# EasyEDA Pro project Analog_Buck.eprj

# Schematic Schematic1
Board Name: Board1; Create Date: 2025-11-09; Page Name: P1; Project Name: Analog_Buck; Schematic Name: Schematic1; Update Date: 2025-11-12; Company: 嘉立创EDA; Page Size: A4; Version: V1.0
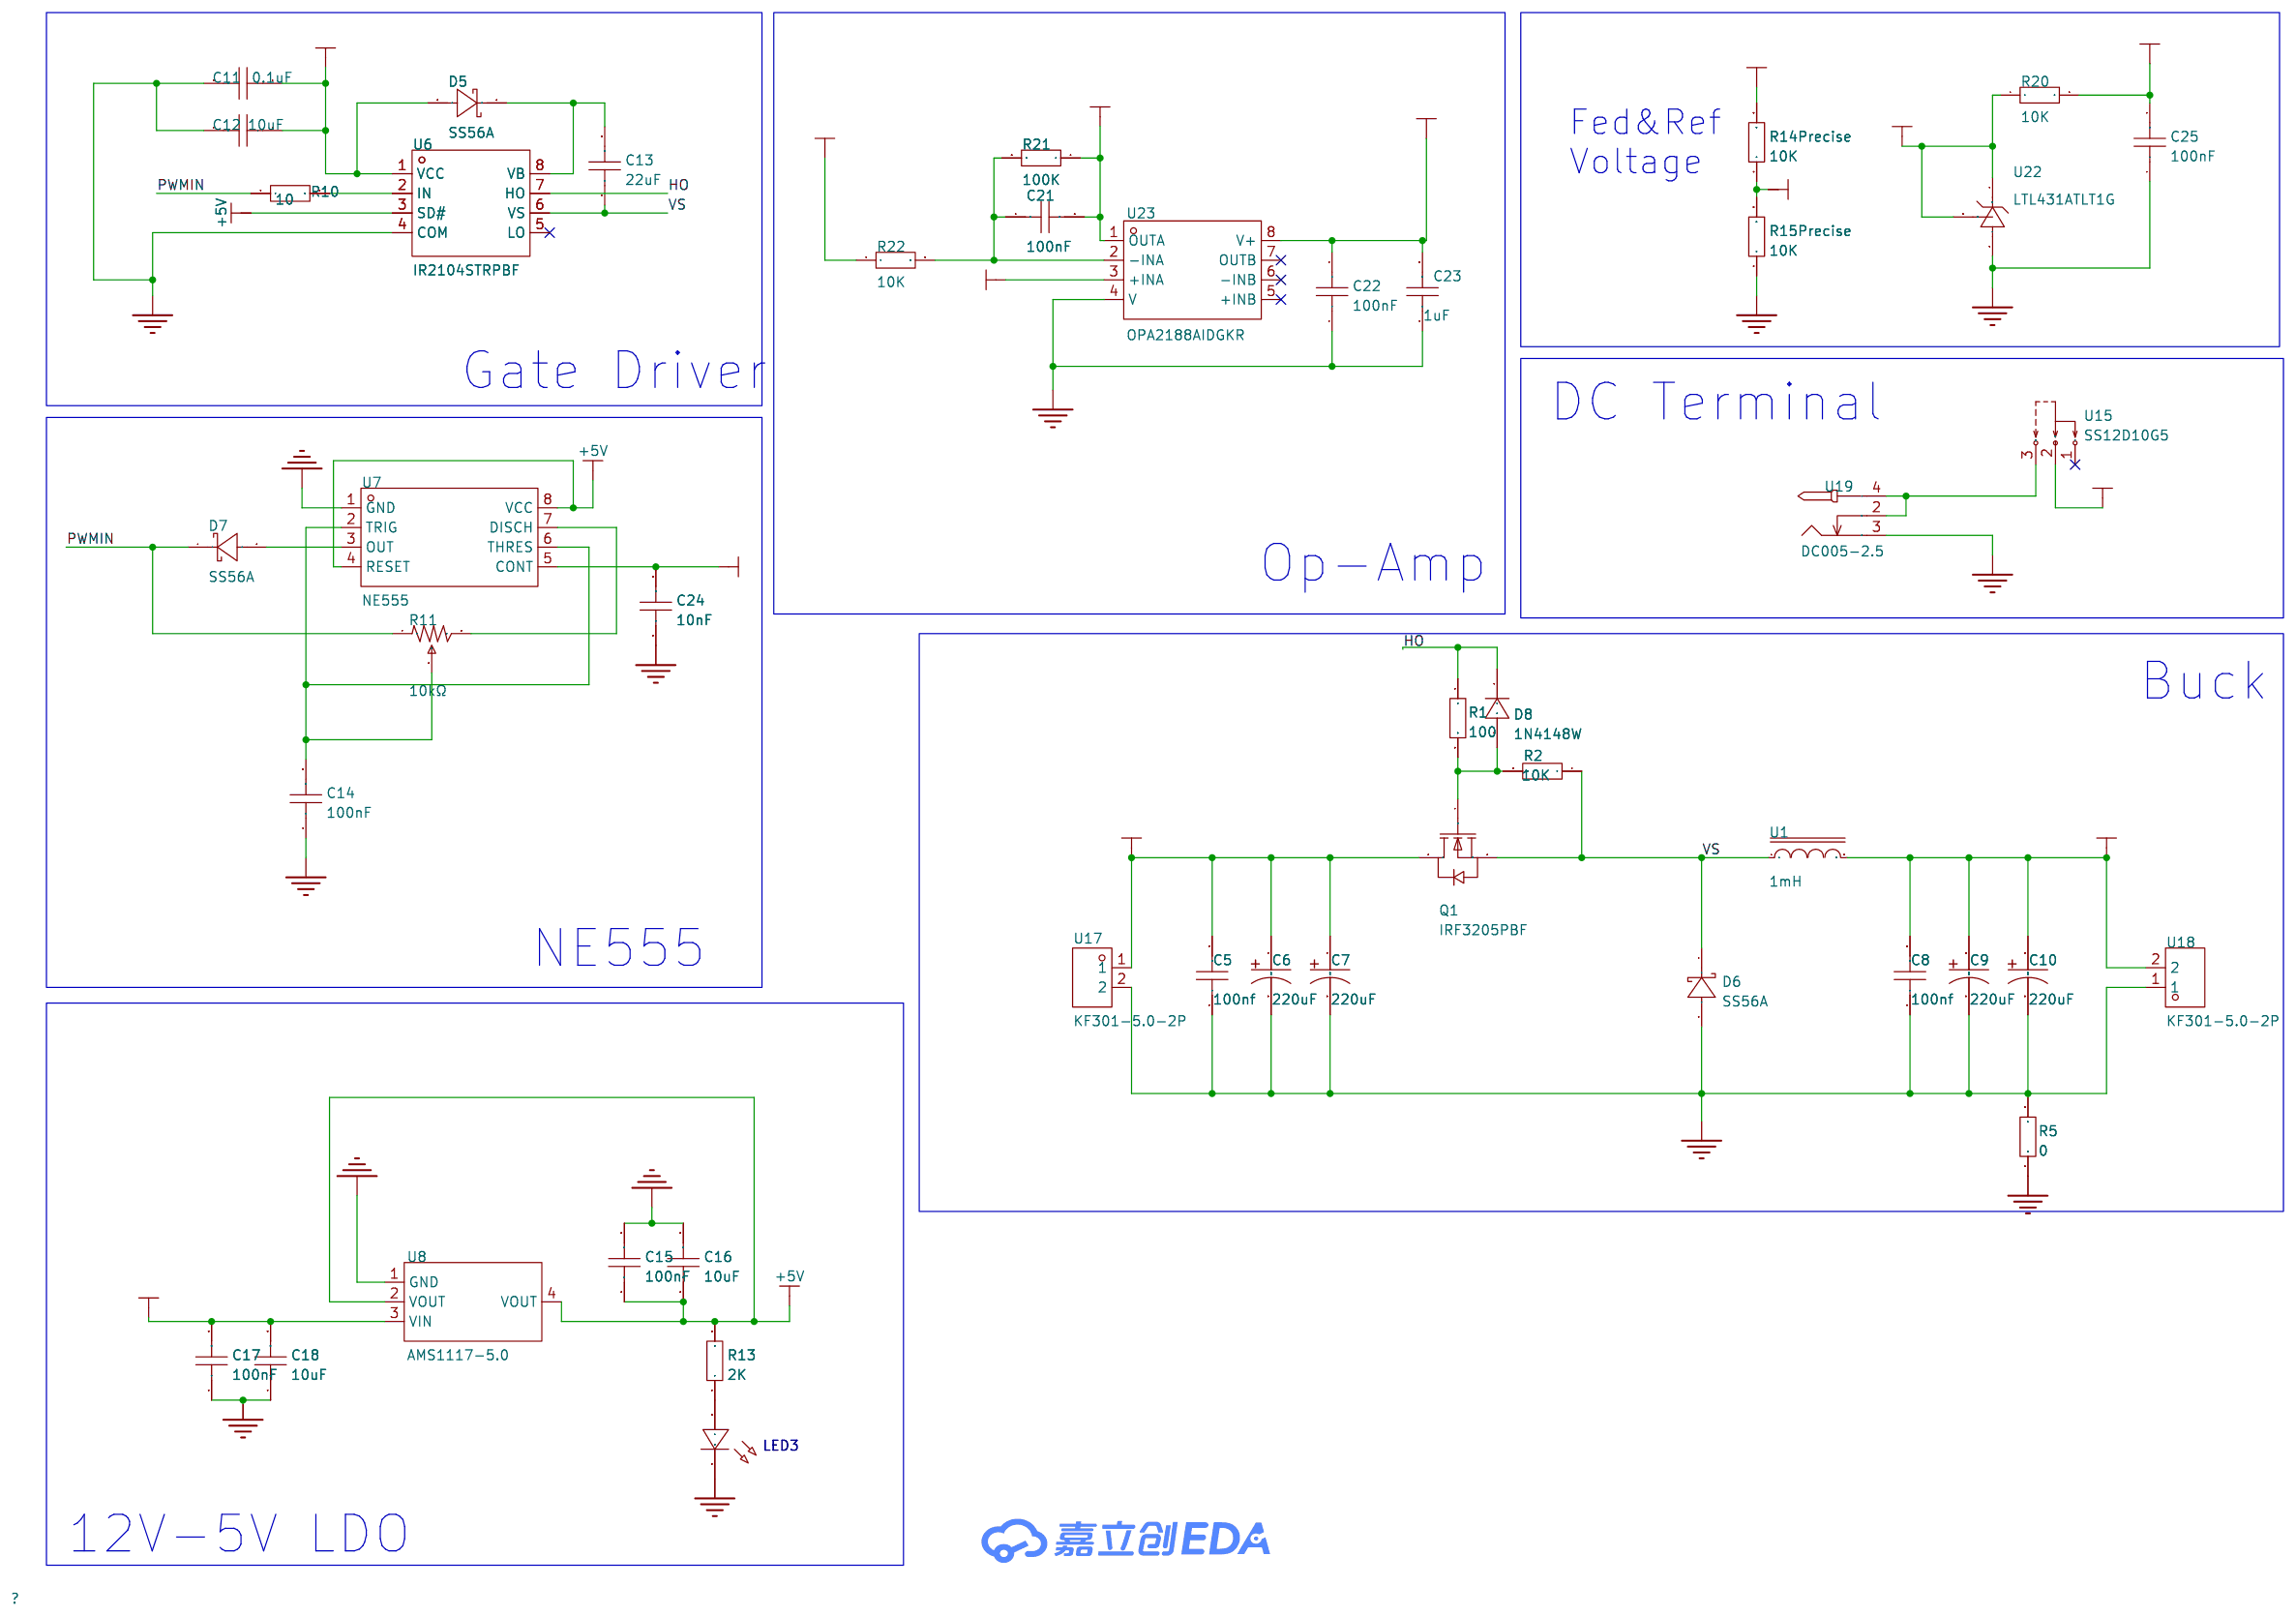
[diagram p0: schematic sheet]

## Parts
C5  100nf  [CAP-TH_L8.5-W5.0-P5.00-D1.2]
C6  220uF  [CAP-TH_BD10.0-P5.00-D0.6-FD]
C7  220uF  [CAP-TH_BD10.0-P5.00-D0.6-FD]
C8  100nf  [CAP-TH_L8.5-W5.0-P5.00-D1.2]
C9  220uF  [CAP-TH_BD10.0-P5.00-D0.6-FD]
C10  220uF  [CAP-TH_BD10.0-P5.00-D0.6-FD]
C11  0.1uF  [C0603]
C12  10uF  [C0603]
C13  22uF  [CAP-TH_L6.0-W3.8-P5.08-D0.6]
C14  100nF  [C0603]
C15  100nF  [C0603]
C16  10uF  [C0603]
C17  100nF  [C0603]
C18  10uF  [C0603]
C21  100nF  [C0603]
C22  100nF  [C0603]
C23  1uF  [C0603]
C24  10nF  [C0603]
C25  100nF  [C0603]
D5  SS56A  [SMA_L4.2-W2.6-LS5.0-RD]
D6  SS56A  [SMA_L4.2-W2.6-LS5.0-RD]
D7  SS56A  [SMA_L4.2-W2.6-LS5.0-RD]
D8  1N4148W  [SOD-123F_L2.7-W1.6-LS3.8-RD]
LED3  -  [LED_0805]
Q1  IRF3205PBF  [TO-220-3_L10.0-W4.5-P2.54-L]
R1  100  [R0603]
R2  10K  [R0603]
R5  0  [R0603]
R10  10  [R0603]
R11  10kΩ  [RES-ADJ-TH_3P-L9.5-W4.9-P2.50-L_3296W]
R13  2K  [R0603]
R14Precise  10K  [R0603]
R15Precise  10K  [R0603]
R20  10K  [R0603]
R21  100K  [R0603]
R22  10K  [R0603]
U1  1mH  [IND-TH_L33.0-W15.6-P15.00-D1.5]
U6  IR2104STRPBF  [SOIC-8_L4.9-W3.9-P1.27-LS6.0-BL]
U7  NE555  [SOP-8_L5.0-W4.0-P1.27-LS6.0-BL]
U8  AMS1117-5.0  [SOT-223_L6.5-W3.5-P2.30-LS7.0-BR]
U15  SS12D10G5  [SW-TH_SHOU-HAN_SS12D10G4]
U17  KF301-5.0-2P  [CONN-TH_P5.00_KF301-5.0-2P]
U18  KF301-5.0-2P  [CONN-TH_P5.00_KF301-5.0-2P]
U19  DC005-2.5  [DC-IN-TH_DC005-2.5MM]
U22  LTL431ATLT1G  [SOT-23-3_L2.9-W1.3-P1.90-LS2.4-BR]
U23  OPA2188AIDGKR  [VSSOP-8_L3.0-W3.0-P0.65-LS4.9-BL]

## Library data of the parts
C5 C8 = CT4-0805B104K500F3: 容值:100nF;精度:±10%;额定电压:50V;温度系数:X7R;; LCSC Part Name: 100nF ±10% 50V C3型（直脚）; Supplier Part: C84772; Manufacturer: FH(风华); Supplier Footprint: 插件,P=5.08mm; JLCPCB Part Class: 扩展库; Datasheet: https://atta.szlcsc.com/upload/public/pdf/source/20190402/C385200_059806A6312B28FF1421A2413EB641E1.pdf; Supplier: LCSC; Tolerance: ±10%; Voltage Rated: 50V; Temperature Coefficient: X7R
C6 C7 C9 C10 = ECF1JM221G17OTPO: LCSC Part Name: 220uF ±20% 63V; Supplier Part: C783503; Manufacturer: Yunxing(云星); Supplier Footprint: 插件,D10xL17mm; JLCPCB Part Class: Extended Part; Datasheet: https://item.szlcsc.com/datasheet/ECF1JM221G17OTPO/837828.html; Supplier: LCSC; Tolerance: ±20%; Voltage Rating: 63V; Diameter: 10mm; Height - Seated (Max): 17mm; Lifetime: 6000hrs@105℃; Operating Temperature: -40℃~+105℃
C11 C12 C14-C18 C21-C25 = CAP_0603: Supplier Footprint: 0603
C13 = CD1H225KC9BER1F100: 容值:2.2uF;精度:±10%;额定电压:50V;温度系数:X7R;; LCSC Part Name: 2.2uF ±10% 50V; Supplier Part: C2976626; Manufacturer: Dersonic(德尔创); Supplier Footprint: 插件,P=5.08mm; JLCPCB Part Class: Extended Part; Datasheet: https://item.szlcsc.com/datasheet/CD1H225KC9BER1F100/3383616.html; Supplier: LCSC; Tolerance: ±10%; Voltage Rating: 50V; Temperature Coefficient: X7R
D5-D7 = SS56A: 二极管配置:独立式;正向压降(Vf):700mV@5A;直流反向耐压(Vr):60V;整流电流:5A;; LCSC Part Name: 电压:60V 电流:5A; Supplier Part: C842793; Manufacturer: FUXINSEMI(富芯森美); Supplier Footprint: SMA(DO-214AC); JLCPCB Part Class: 扩展库; Datasheet: https://item.szlcsc.com/datasheet/SS56A/901411.html; Supplier: LCSC; Diode Configuration: 独立式; Voltage - Forward(Vf@If): 700mV@5A; Voltage - DC Reverse(Vr): 60V; Current - Rectified: 5A; Reverse Leakage Current (Ir): 500nA; Operating Junction Temperature Range: -55℃~+150℃; Non-Repetitive Peak Forward Surge Current: 150A
D8 = 1N4148W_C81598: Supplier Part: C81598; Manufacturer: ST(先科); Supplier Footprint: SOD-123; JLCPCB Part Class: 基础库; Datasheet: https://item.szlcsc.com/datasheet/1N4148W/82750.html; Supplier: LCSC; Diode Configuration: 独立式; Voltage - Forward(Vf@If): 1V@50mA; Voltage - DC Reverse(Vr): 75V; Current - Rectified: 150mA; Pd - Power Dissipation: 400mW; Reverse Leakage Current (Ir): 1uA@75V; Reverse Recovery Time (trr): 4ns; Non-Repetitive Peak Forward Surge Current: 1A
LED3 = LED_0805-G: Supplier Footprint: 0805
Q1 = IRF3205PBF: 类型:1个N沟道;漏源电压(Vdss):55V;连续漏极电流(Id):110A;导通电阻(RDS(on)@Vgs,Id):8mΩ@10V,62A;功率(Pd):200W;阈值电压(Vgs(th)@Id):4V@250uA;; LCSC Part Name: 1个N沟道 耐压:55V 电流:110A; Supplier Part: C2561; Manufacturer: Infineon(英飞凌); Supplier Footprint: TO-220AB; JLCPCB Part Class: 扩展库; Datasheet: https://atta.szlcsc.com/upload/public/pdf/source/20201126/C2561_C063ADD03C5ACFC796E423BE08ECDD89.pdf; Supplier: LCSC; Type: 1个N沟道; Drain Source Voltage (Vdss): 55V; Continuous Drain Current (Id): 110A; Drain Source On Resistance (RDS(on)@Vgs,Id): 8mΩ@10V,62A; Power Dissipation (Pd): 200W; Gate Threshold Voltage (Vgs(th)@Id): 4V@250uA; Total Gate Charge (Qg@Vgs): 146nC; Input Capacitance (Ciss@Vds): 3.247nF; Reverse Transfer Capacitance (Crss@Vds): 211pF; Operating Temperature: -55℃~+175℃
R1 R2 R5 R10 R13 R14Precise R15Precise R20-R22 = Res_0603: Supplier Footprint: 0603
R11 = 3296W-1-103LF_C49190453: LCSC Part Name: 3296W-1-103LF; Supplier Part: C49190453; Manufacturer: JIERR(捷而瑞); Manufacturer Part: 3296W-1-103LF; Supplier Footprint: 插件-3P,9.5x4.9mm; JLCPCB Part Class: 扩展库; Datasheet: https://item.szlcsc.com/datasheet/3296W-1-103LF/51587046.html; Supplier: LCSC; Tolerance: ±10%; Power(Watts): 500mW; Temperature Coefficient: ±250ppm/℃; Number of Turns: 28
U1 = XR106125TS470MV1L5: 电感值:47uH;精度:±10%;额定电流:12A;类型:磁环电感;; LCSC Part Name: 47uH ±10% 磁环电感; Supplier Part: C22358529; Manufacturer: XR(祥如); Supplier Footprint: 插件,33x15.6mm; JLCPCB Part Class: 扩展库; Datasheet: https://atta.szlcsc.com/upload/public/pdf/source/20240313/975BD6823DE6C304357683F4CE864895.pdf; Supplier: LCSC; Tolerance: ±10%; Rated Current: 12A; Type: 磁环电感; Wire Diameter: 1.5mm
U6 = IR2104STRPBF: 驱动配置:半桥;负载类型:IGBT；MOSFET;驱动通道数:2;灌电流(IOL):270mA;拉电流(IOH):130mA;工作电压:10V~20V;上升时间(tr):100ns;下降时间(tf):50ns;; LCSC Part Name: 半桥驱动器; Supplier Part: C2960; Manufacturer: Infineon(英飞凌); Supplier Footprint: SOIC-8; JLCPCB Part Class: 扩展库; Datasheet: https://item.szlcsc.com/datasheet/IR2104STRPBF/3342.html; Supplier: LCSC; Driven Configuration: 半桥; Load Type: IGBT；MOSFET; Number of Drivers: 2; Current - Output Low(IOL): 270mA; Current - Output High(IOH): 130mA; Voltage - Supply: 10V~20V; Rise Time: 100ns; Fall Time: 50ns; Propagation Delay tpLH: 680ns; Propagation Delay tpHL: 150ns; Features: 欠压保护(UVP); Operating Temperature: -40℃~+150℃@(Tj); Quiescent Current(Iq): 150uA
U7 = NE555: Supplier Part: C504549; Supplier Footprint: SOP-8-4.0mm; JLCPCB Part Class: 扩展库; Supplier: LCSC
U8 = AMS1117-5.0_C6187: LCSC Part Name: 输入15V 输出5V 1A; Supplier Part: C6187; Manufacturer: AMS; Supplier Footprint: SOT-223; JLCPCB Part Class: 基础库; Datasheet: https://item.szlcsc.com/datasheet/AMS1117-5.0/6653.html; Supplier: LCSC; Output Type: 固定; Voltage - Supply: 15V; Output Voltage: 5V; Output Current: 1A; Power Supply Rejection Ratio (PSRR): 60dB; Voltage Dropout: 1.3V; Operating Temperature: -40℃~+125℃; Output Configuration: 正极; Number of Outputs: 1
U15 = SS12D10G5: 电路结构:单刀双掷;安装方式:直插;额定电流:2A;额定电压:125V;工作寿命:3千次;; LCSC Part Name: 两档立式插件 3脚拨动开关 柄长5.0mm; Supplier Part: C7431054; Manufacturer: SHOU HAN(首韩); Supplier Footprint: 插件,12.7x6.7mm; JLCPCB Part Class: 扩展库; Datasheet: https://item.szlcsc.com/datasheet/SS12D10G5/8431406.html; Supplier: LCSC; Circuit: 单刀双掷; Length: 12.7mm; Width: 6.7mm; Mounting Type: 直插; Current Rating: 2A; Voltage Rating: 125V; Life: 3千次; Operating Temperature: -25℃~+70℃
U17 U18 = KF301-5.0-2P: 结构:1x2P;间距:5mm;颜色:蓝色;安装方式:直插;额定电流:17A;额定电压:250V;排数:1;线规 - AWG:14~22;线规 - 平方毫米:1.5;每排PIN数:2;工作温度范围:-30℃~+120℃;; LCSC Part Name: 5mm 1x2P 排数:1 每排P数:2 直插; Supplier Part: C474881; Manufacturer: KEFA(科发); Supplier Footprint: 插件,P=5mm; JLCPCB Part Class: 扩展库; Datasheet: https://atta.szlcsc.com/upload/public/pdf/source/20230317/03A5B5FC229D6F9225E8F51DA1A4E80A.pdf; Supplier: LCSC; Structure: 1x2P; Pitch: 5mm; Color: 蓝色; Mounting Style: 直插; Current Rating (Max): 17A; Voltage Rating (Max): 250V; Number of Pins: 2P; Number of Rows: 1; Wire Gauge - AWG: 14~22; Wire Gauge - mm2: 1.5; Number of PINs Per Row: 2; Operating Temperature Range: -30℃~+120℃
U19 = DC005-2.5: LCSC Part Name: DC电源插座 内径:2.5mm 外径:6.3mm; Supplier Part: C7507454; Manufacturer: SHOU HAN(首韩); Supplier Footprint: 插件; JLCPCB Part Class: 扩展库; Datasheet: https://item.szlcsc.com/datasheet/DC005-2.5/8598476.html; Supplier: LCSC; Connector Type: DC电源插座; Mounting Type: 弯插; Inside Contact Diameter: 2.5mm; Outside Contact Diameter: 6.3mm; Current Rating: 500mA; Voltage Rating (Max): 30V; Operating Temperature: -25℃~+70℃
U22 = LTL431ATLT1G: LCSC Part Name: 2.5V~36V 100mA; Supplier Part: C83052; Manufacturer: LRC(乐山无线电); Supplier Footprint: SOT-23(SOT-23-3); JLCPCB Part Class: Extended Part; Datasheet: https://atta.szlcsc.com/upload/public/pdf/source/20161024/1477288490977.pdf; Supplier: LCSC; Output Type: 可编程; Output Voltage: 2.5V~36V; Output Current: 100mA; Minimum Cathode Current for Regulation: 1mA; Operating Temperature: -40℃~+125℃@(TA)
U23 = OPA2188AIDGKR: Supplier Part: C2865632; Manufacturer: TI(德州仪器); Supplier Footprint: VSSOP-8; JLCPCB Part Class: 扩展库; Datasheet: https://www.ti.com/cn/lit/gpn/opa2188; Supplier: LCSC; Number of Channels: 双路; Gain Bandwidth Product: 2MHz; Ib - Input Bias Current: 160pA; Vos - Input Offset Voltage: 6uV; Slew Rate: 0.8V/us; Operating Temperature: -40℃~+105℃

## Nets
+5V: C15.1 C16.1 R13.2 U6.3(SD#) U7.4(RESET) U7.8(VCC) U8.2(VOUT) U8.4(VOUT)
+12V: C11.1 C12.1 C17.2 C18.2 C22.2 C23.2 C25.2 D5.2(A) R20.2 U6.1(VCC) U8.3(VIN) U15.2 U23.8(V+)
DGND: C11.2 C12.2 C14.1 C15.2 C16.2 C17.1 C18.1 C22.1 C23.1 C24.1 C25.1 LED3.1(C) R5.1 U6.4(COM) U7.1(GND) U8.1(GND) U19.3 U22.3(A) U23.4(V)
GND: C5.1 C6.2 C7.2 C8.1 C9.2 C10.2 D6.2(A) R5.2 R15Precise.1 U17.2 U18.1
VIN: C5.2 C6.1 C7.1 Q1.2(D) U17.1
HO: D8.1(K) R1.1 U6.7(HO)
PWMIN: D7.1(K) R10.1 R11.1
VCON: C21.2 C24.2 R21.1 U7.5(CONT) U23.1(OUTA)
VFB: R14Precise.1 R15Precise.2 R22.1
VOUT: C8.2 C9.1 C10.1 R14Precise.2 U1.2 U18.2
VREF: R20.1 U22.1(C) U22.2(REF) U23.3(+INA)
VS: C13.1 D6.1(K) Q1.3(S) R2.1 U1.1 U6.6(VS)
$1N485: C13.2 D5.1(K) U6.8(VB)
$1N490: R10.2 U6.2(IN)
$1N1299: D8.2(A) Q1.1(G) R1.2 R2.2
$1N2292: D7.2(A) U7.3(OUT)
$1N2346: C14.2 R11.2 U7.2(TRIG) U7.6(THRES)
$1N2402: R11.3 U7.7(DISCH)
$1N3368: U15.3 U19.2 U19.4
$1N5855: LED3.2(A) R13.1
$1N13692: C21.1 R21.2 R22.2 U23.2(-INA)

Not connected (* = marked no-connect by the designer): U6 5(LO)*; U15 1*; U23 5(+INB)* 6(-INB)* 7(OUTB)*

## Notes on the sheet
- Fed&Ref
  Voltage
- Gate Driver
- DC Terminal
- Op-Amp
- Buck
- NE555
- 12V-5V LDO

# Board PCB1
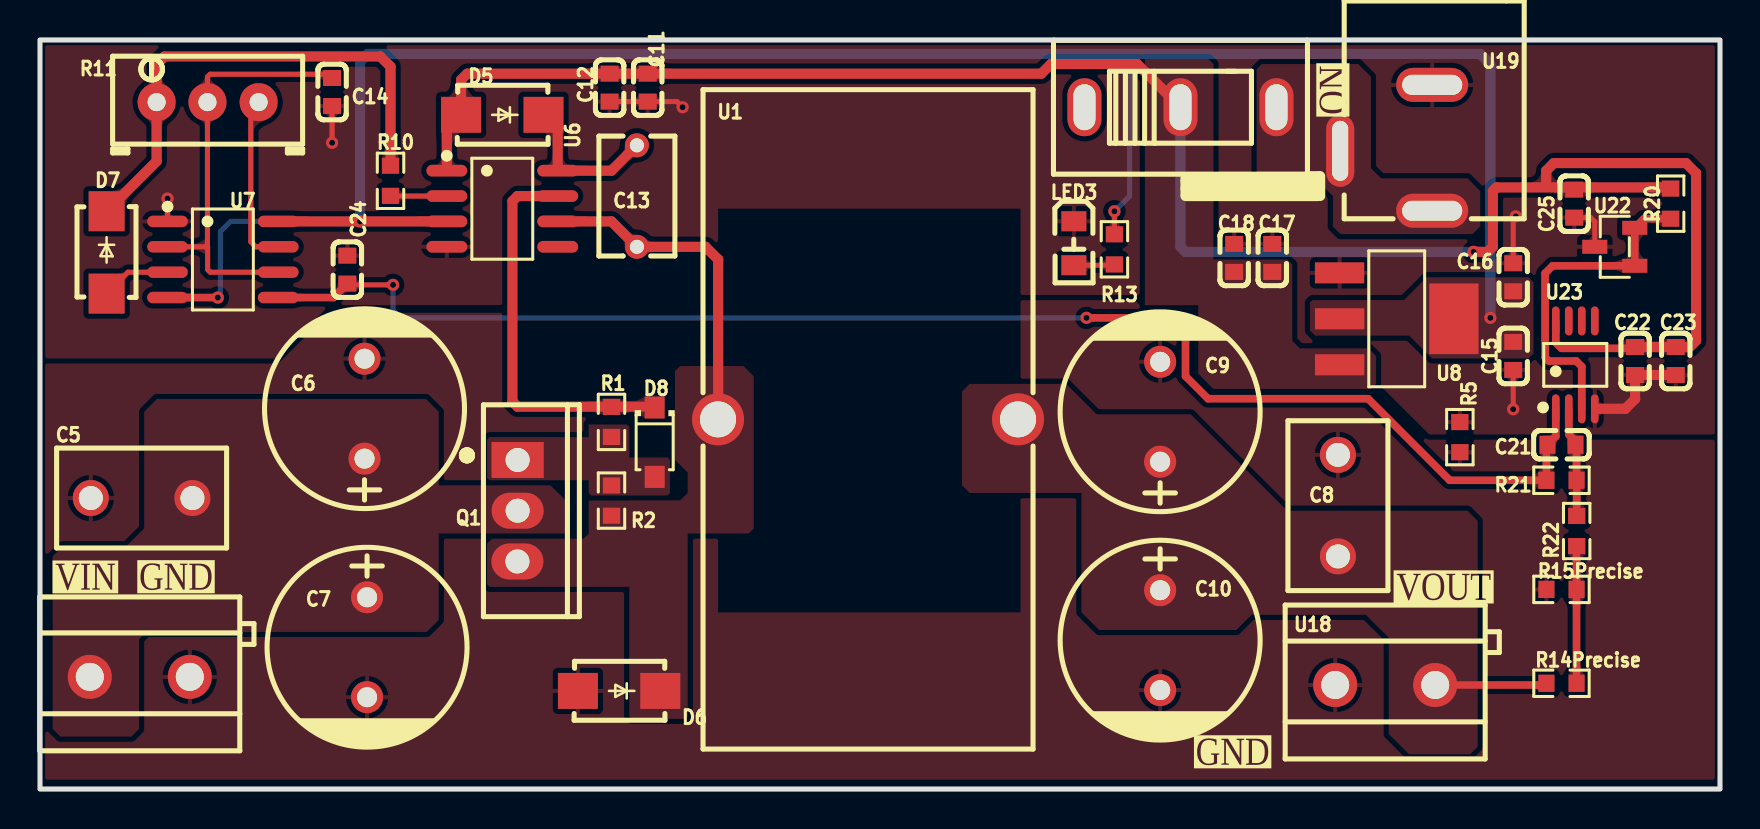
[diagram p1: board, top side]
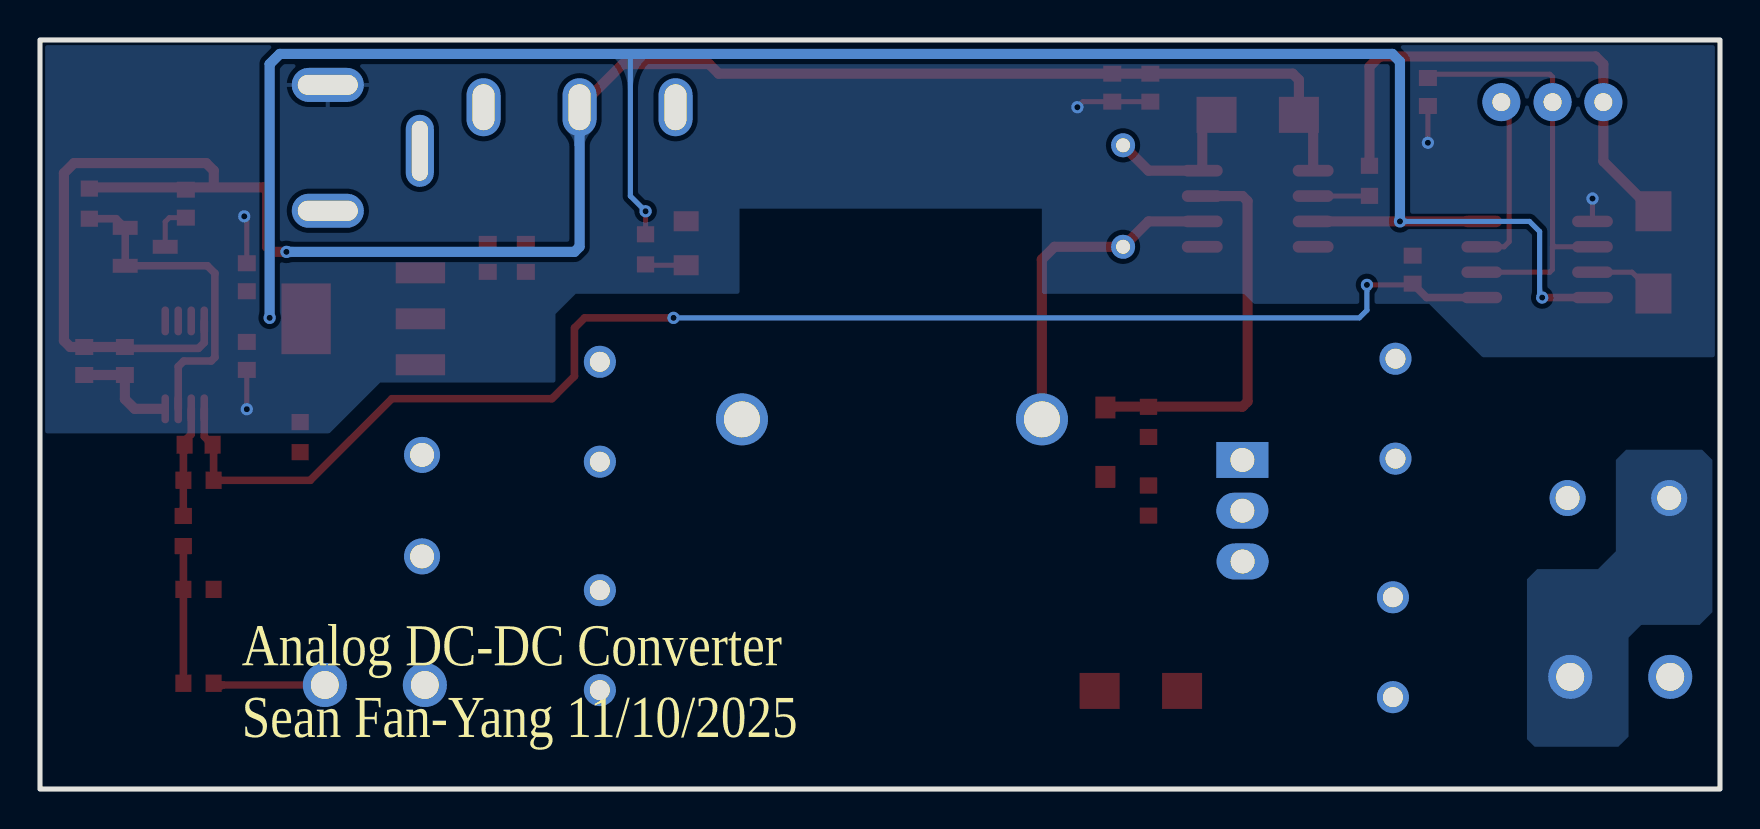
[diagram p2: board, bottom side, seen from below]

Outline 84 x 37.49 mm; copper layers: Top Layer, Bottom Layer. Coordinates in mm from the lower left corner of the outline.
Outline path: rectangle 0,37.49 84,0
Stack: Top Layer 0.035mm / Dielectric1 1.51mm FR4 er 4.5 / Bottom Layer 0.035mm

## Design rules (mm)
template: JLCPCB Capability(Two Layers Board)
spacing copperThickness1oz (default): track to track 0.102, other pairs 0.152 to 0.3
spacing copperThickness2oz: track to track 0.203, other pairs 0.152 to 0.3
track width copperThickness1oz (default): min 0.127, default 0.254, max 2.54
track width copperThickness2oz: min 0.203, default 0.254, max 2.54
differential pair differentialPair (default): width min 0.127, default 0.254, max 2.54; gap min 0.152, default 0.152
via viaSize (default): diameter min 0.5, default 0.61, max 10; hole min 0.3, default 0.305, max 6.3

## Placement (name value [footprint] x y rotation side)
C5  100nf  [CAP-TH_L8.5-W5.0-P5.00-D1.2]  5.08 14.56 0 top
C6  220uF  [CAP-TH_BD10.0-P5.00-D0.6-FD]  16.23 19.03 90 top
C7  220uF  [CAP-TH_BD10.0-P5.00-D0.6-FD]  16.35 7.1 270 top
C8  100nf  [CAP-TH_L8.5-W5.0-P5.00-D1.2]  64.9 14.18 270 top
C9  220uF  [CAP-TH_BD10.0-P5.00-D0.6-FD]  56.01 18.88 90 top
C10  220uF  [CAP-TH_BD10.0-P5.00-D0.6-FD]  56.01 7.45 270 top
C11  0.1uF  [C0603]  30.39 35.1 270 top
C12  10uF  [C0603]  28.48 35.1 270 top
C13  22uF  [CAP-TH_L6.0-W3.8-P5.08-D0.6]  29.84 29.68 90 top
C14  100nF  [C0603]  14.61 34.88 90 top
C15  100nF  [C0603]  73.66 21.67 270 top
C16  10uF  [C0603]  73.66 25.61 90 top
C17  100nF  [C0603]  61.61 26.58 270 top
C18  10uF  [C0603]  59.71 26.58 270 top
C21  100nF  [C0603]  76.07 17.23 180 top
C22  100nF  [C0603]  79.76 21.42 90 top
C23  1uF  [C0603]  81.79 21.42 90 top
C24  10nF  [C0603]  15.37 25.99 270 top
C25  100nF  [C0603]  76.71 29.3 90 top
D5  SS56A  [SMA_L4.2-W2.6-LS5.0-RD]  23.11 33.74 180 top
D6  SS56A  [SMA_L4.2-W2.6-LS5.0-RD]  28.96 4.91 180 top
D7  SS56A  [SMA_L4.2-W2.6-LS5.0-RD]  3.33 26.85 270 top
D8  1N4148W  [SOD-123F_L2.7-W1.6-LS3.8-RD]  30.73 17.36 270 top
LED3  -  [LED_0805]  51.69 27.26 270 top
Q1  IRF3205PBF  [TO-220-3_L10.0-W4.5-P2.54-L]  23.88 13.93 270 top
R1  100  [R0603]  28.57 18.37 270 top
R2  10K  [R0603]  28.57 14.44 90 top
R5  0  [R0603]  70.99 17.61 270 top
R10  10  [R0603]  17.53 30.44 270 top
R11  10kΩ  [RES-ADJ-TH_3P-L9.5-W4.9-P2.50-L_3296W]  8.38 34.38 0 top
R13  2K  [R0603]  53.72 27.01 90 top
R14Precise  10K  [R0603]  76.07 5.29 180 top
R15Precise  10K  [R0603]  76.07 9.99 0 top
R20  10K  [R0603]  81.53 29.3 90 top
R21  100K  [R0603]  76.07 15.45 0 top
R22  10K  [R0603]  76.84 12.91 90 top
U1  1mH  [IND-TH_L33.0-W15.6-P15.00-D1.5]  41.4 18.5 0 top
U6  IR2104STRPBF  [SOIC-8_L4.9-W3.9-P1.27-LS6.0-BL]  23.11 29.04 270 top
U7  NE555  [SOP-8_L5.0-W4.0-P1.27-LS6.0-BL]  9.14 26.5 270 top
U8  AMS1117-5.0  [SOT-223_L6.5-W3.5-P2.30-LS7.0-BR]  67.84 23.53 180 top
U15  SS12D10G5  [SW-TH_SHOU-HAN_SS12D10G4]  57.02 34.12 0 top
U17  KF301-5.0-2P  [CONN-TH_P5.00_KF301-5.0-2P]  4.99 5.61 0 top
U18  KF301-5.0-2P  [CONN-TH_P5.00_KF301-5.0-2P]  67.26 5.21 0 top
U19  DC005-2.5  [DC-IN-TH_DC005-2.5MM]  67.31 32.09 270 top
U22  LTL431ATLT1G  [SOT-23-3_L2.9-W1.3-P1.90-LS2.4-BR]  78.74 27.14 0 top
U23  OPA2188AIDGKR  [VSSOP-8_L3.0-W3.0-P0.65-LS4.9-BL]  76.76 21.23 0 top

## Footprints (pads in the part's own frame, mm; a bottom-side part is the same pattern mirrored in y, then rotated)
C0603
  rect 0.8x0.9 smd: 1(-0.7,0) 2(0.7,0)
CAP-TH_BD10.0-P5.00-D0.6-FD
  round 1.6 hole 1: 1(-2.5,0) 2(2.5,0)
CAP-TH_L6.0-W3.8-P5.08-D0.6
  round 1.2 hole 0.7: 1(-2.54,0) 2(2.54,0)
CAP-TH_L8.5-W5.0-P5.00-D1.2
  round 1.8 hole 1.2: 1(-2.54,0) 2(2.54,0)
CONN-TH_P5.00_KF301-5.0-2P
  round 2.2 hole 1.4: 1(-2.5,0) 2(2.5,0)
DC-IN-TH_DC005-2.5MM
  oval 3.6x1.4 hole 3x0.8: 2(0.15,-2.3)
  oval 1.7x3.6 hole 1x3: 3(-3.15,2.3) 4(3.15,2.3)
IND-TH_L33.0-W15.6-P15.00-D1.5
  round 2.6 hole 1.8: 1(-7.5,0) 2(7.5,0)
LED_0805
  rect 1x1.25 smd: 1(-1.15,0.005) 2(1.05,0.005)
R0603
  rect 0.806x0.864 smd: 1(-0.753,0) 2(0.753,0)
RES-ADJ-TH_3P-L9.5-W4.9-P2.50-L_3296W
  round 1.9 hole 0.9: 1(-2.55,0) 2(-0.01,0) 3(2.55,0)
SMA_L4.2-W2.6-LS5.0-RD
  rect 2x1.8 smd: 1(-2.06,0) 2(2.06,0)
SOD-123F_L2.7-W1.6-LS3.8-RD
  rect 1.1x1 smd: 1(-1.735,0) 2(1.735,0)
SOIC-8_L4.9-W3.9-P1.27-LS6.0-BL
  oval 0.588x2.045 smd: 1(-1.905,-2.772) 2(-0.635,-2.772) 3(0.635,-2.772) 4(1.905,-2.772) 5(1.905,2.772) 6(0.635,2.772) 7(-0.635,2.772) 8(-1.905,2.772)
SOP-8_L5.0-W4.0-P1.27-LS6.0-BL
  oval 0.574x2.035 smd: 1(-1.905,-2.768) 2(-0.635,-2.768) 3(0.635,-2.768) 4(1.905,-2.768) 5(1.905,2.768) 6(0.635,2.768) 7(-0.635,2.768) 8(-1.905,2.768)
SOT-23-3_L2.9-W1.3-P1.90-LS2.4-BR
  rect 1.25x0.7 smd: 1(1,-0.95) 2(1,0.95) 3(-1,0)
SOT-223_L6.5-W3.5-P2.30-LS7.0-BR
  rect 2.465x1.05 smd: 1(2.857,-2.3) 2(2.857,0) 3(2.857,2.3)
  rect 2.465x3.54 smd: 4(-2.857,0)
SW-TH_SHOU-HAN_SS12D10G4
  oval 1.7x2.9 hole 1.1x2.3: 1(-4.8,0) 2(0,0) 3(4.8,0)
TO-220-3_L10.0-W4.5-P2.54-L
  rect 1.8x2.6 hole 1.2: 1(-2.54,0.005)
  oval 1.8x2.6 hole 1.2: 2(0,0.005) 3(2.54,-0.005)
VSSOP-8_L3.0-W3.0-P0.65-LS4.9-BL
  oval 0.38x1.45 smd: 1(-0.975,-2.2) 2(-0.325,-2.2) 3(0.325,-2.2) 4(0.975,-2.2) 5(0.975,2.2) 6(0.325,2.2) 7(-0.325,2.2) 8(-0.975,2.2)

## Nets
As in the schematic.

Pads without a net: U6 5; U15 1; U23 5 6 7

## Via types
v1: diameter 0.61, hole 0.305, Top Layer to Bottom Layer, 12 vias

## Routing (per net, layer and track width the routed paths; a pad name or vN(x,y) marks a point on that pad's centre or on a via; arc(x,y) is an arc through that point)
+5V: length 108
  Top Layer w0.254: v1(53.72,28.91) R13.2
  Top Layer w0.381: U7.4 v1(8.89,24.6)
  Top Layer w0.508: 12.17,28.41 v1(16,28.41) U6.3
  Bottom Layer w0.254: v1(16,28.41) 9.53,28.41 9.02,27.9 9.02,24.72 v1(8.89,24.6) ; 54.48,36.66 54.48,29.68 v1(53.72,28.91)
  Bottom Layer w0.508: v1(16,28.41) 16,36.41 16.38,36.79 72.01,36.79 72.52,36.28 v1(72.52,23.58)
+12V: length 102
  Top Layer w0.381: C22.2 79.69,22.06 76.07,22.06 75.79,22.34 U23.8
  Top Layer w0.508: C22.2 C23.2 82.49,22.12 82.8,22.44 82.8,30.82 82.3,31.33 75.69,31.33 75.31,30.95 75.31,30.18 ; U15.2 54.86,36.28 50.55,36.28 50.07,35.8 C11.1 C12.1 21.36,35.8 21.05,35.49 D5.2 20.34,33.03 U6.1 ; R20.2 81.47,30.11 72.82,30.11 72.64,29.93 72.64,27.14 72.39,26.88 v1(71.68,26.88)
  Bottom Layer w0.508: v1(71.68,26.88) 57.28,26.88 57.02,27.14 U15.2
DGND: length 18.8
  Top Layer w0.254: C14.1 v1(14.61,32.34) ; C25.1 77.53,28.59 77.74,28.39 U22.3 ; v1(73.79,28.66) 73.66,28.53 C16.2 ; C15.2 v1(73.66,19.01) ; C12.2 C11.2 30.58,34.4 30.61,34.38 ; v1(32.13,34.12) 31.85,34.4 30.61,34.4 ; U7.1 v1(6.38,29.55)
  Top Layer w0.508: C23.1 C22.1 79.76,19.52 79.27,19.03 77.87,19.03
HO: length 19.6
  Top Layer w0.508: D8.1 30.69,19.13 23.88,19.13 23.62,19.39 23.62,29.42 23.88,29.68 U6.7
PWMIN: length 25.4
  Top Layer w0.508: D7.1 5.83,31.42 R11.1 5.83,36.27 6.22,36.66 17.02,36.66 17.53,36.15 R10.1
VCON: length 73.7
  Top Layer w0.254: C24.2 15.43,25.23 v1(17.65,25.23)
  Top Layer w0.381: v1(52.32,23.58) 56.77,23.58 57.28,23.07 57.28,20.66 58.4,19.53 66.4,19.53 70.49,15.45 R21.1 75.32,17.18 75.79,17.64 U23.1 ; C24.2 14.67,24.6 U7.5
  Bottom Layer w0.254: v1(17.65,25.23) 17.65,23.96 18.03,23.58 v1(52.32,23.58)
VFB: length 6.9
  Top Layer w0.381: R14Precise.1 R15Precise.2 76.83,12.15 R22.1
VOUT: length 5.2
  Top Layer w0.381: U18.2 74.9,5.21 74.94,5.16
VREF: length 16.9
  Top Layer w0.381: R20.1 80.2,28.54 U22.2 U22.1 75.63,26.19 75.26,25.81 75.26,21.6 75.44,21.42 76.81,21.42 77.09,21.14 U23.3
VS: length 16.8
  Top Layer w0.508: U6.6 28.57,28.41 C13.1 33.27,27.14 33.91,26.5 33.91,18.51 U1.1
$1N485: length 7.6
  Top Layer w0.508: D5.1 25.89,33.03 U6.8 28.57,30.95 C13.2
$1N490: length 2.6
  Top Layer w0.254: 17.77,29.68 U6.2
$1N2292: length 3.5
  Top Layer w0.254: 6.38,25.87 4.4,25.87 D7.2
$1N2346: length 21.5
  Top Layer w0.254: 11.91,25.87 8.51,25.87 8.38,25.99 8.38,27.14 ; U7.2 8.25,27.14 8.37,27.25 R11.2 8.37,35.63 8.51,35.77 14.42,35.77 C14.2
$1N2402: length 8.6
  Top Layer w0.254: R11.3 10.54,33.98 10.54,27.39 10.8,27.14 U7.7
$1N5855: length 2
  Top Layer w0.254: R13.1 53.68,26.21 LED3.2
$1N13692: length 5.5
  Top Layer w0.381: U23.2 76.44,17.75 76.77,17.42 C21.1 76.83,17.18 R21.2 76.84,15.44 R22.2

## Copper pours and planes (outline as drawn; the poured copper is in the pictures)
+5V on Top Layer: 63.5,25.61 74.68,25.61 74.68,21.55 63.5,21.55
+12V on Top Layer: 55.25,36.53 58.67,36.53 58.67,20.02 55.25,20.02
+12V on Top Layer: 58.29,26.5 66.8,26.5 66.8,20.02 58.29,20.02
DGND on Top Layer: 84.07,17.74 69.47,17.74 66.93,20.28 58.29,20.41 58.17,23.71 57.15,24.72 23.75,24.72 23.24,24.21 14.48,24.21 11.81,21.55 -0.38,21.55 -2.29,23.45 -2.29,38.57 -2.03,38.82 84.07,38.82
DGND on Bottom Layer: 84.26,17.8 69.53,17.8 66.99,20.34 58.23,20.34 58.23,23.77 57.21,24.79 23.81,24.79 23.3,24.28 14.54,24.28 11.87,21.61 -0.32,21.61 -2.22,23.52 -2.22,38.63 0.7,41.55 82.23,41.55 84.26,39.52
GND on Top Layer: 85.98,17.48 69.47,17.48 67.06,19.9 58.55,19.9 57.66,20.79 57.66,23.96 55.25,23.96 54.74,24.47 36.07,24.47 34.16,26.37 24.51,26.37 23.5,25.36 23.37,25.36 23.37,24.21 22.99,23.83 14.35,23.83 11.81,21.29 -1.52,21.29 -4.83,17.99 -4.83,0.47 85.98,0.47
GND on Bottom Layer: 0.38,16.98 9.65,16.98 9.65,2.12 0.38,2.12
VIN on Top Layer: 0.64,19.52 19.94,19.52 19.94,2.62 0.64,2.62
VIN on Top Layer: 19.69,15.2 26.29,15.2 26.29,12.78 19.69,12.78
VOUT on Top Layer: 52.07,18.75 71.88,18.75 71.88,1.74 52.07,1.74
VOUT on Top Layer: 46.1,20.28 52.83,20.28 52.83,14.82 46.1,14.82
VS on Top Layer: 27.43,21.17 35.69,21.17 35.69,12.78 27.43,12.78
VS on Top Layer: 29.46,14.44 32.38,14.44 32.38,3.51 29.46,3.51
VS on Top Layer: 22.35,12.91 29.59,12.91 29.59,10.12 22.35,10.12
$1N1299 on Top Layer: 22.35,17.61 27.56,17.61 27.56,15.45 22.35,15.45
$1N1299 on Top Layer: 27.43,18.25 29.46,18.25 29.46,16.13 27.43,16.13
$1N1299 on Top Layer: 27.43,16.59 31.5,16.59 31.5,14.69 27.43,14.69
$1N3368 on Top Layer: 60.83,36.28 72.01,36.28 72.01,27.77 60.83,27.77

Small or netless copper shapes (teardrops, artwork), in the pictures only: 96 on Top Layer, 10 on Bottom Layer

## Text on the board
Bottom Silkscreen Layer: Analog DC-DC Converter / Sean Fan-Yang 11/10/2025
Top Silkscreen Layer: ON | VIN | GND | VOUT
